# Altium schematic sheet Sheet_Right.SchDoc
size A3
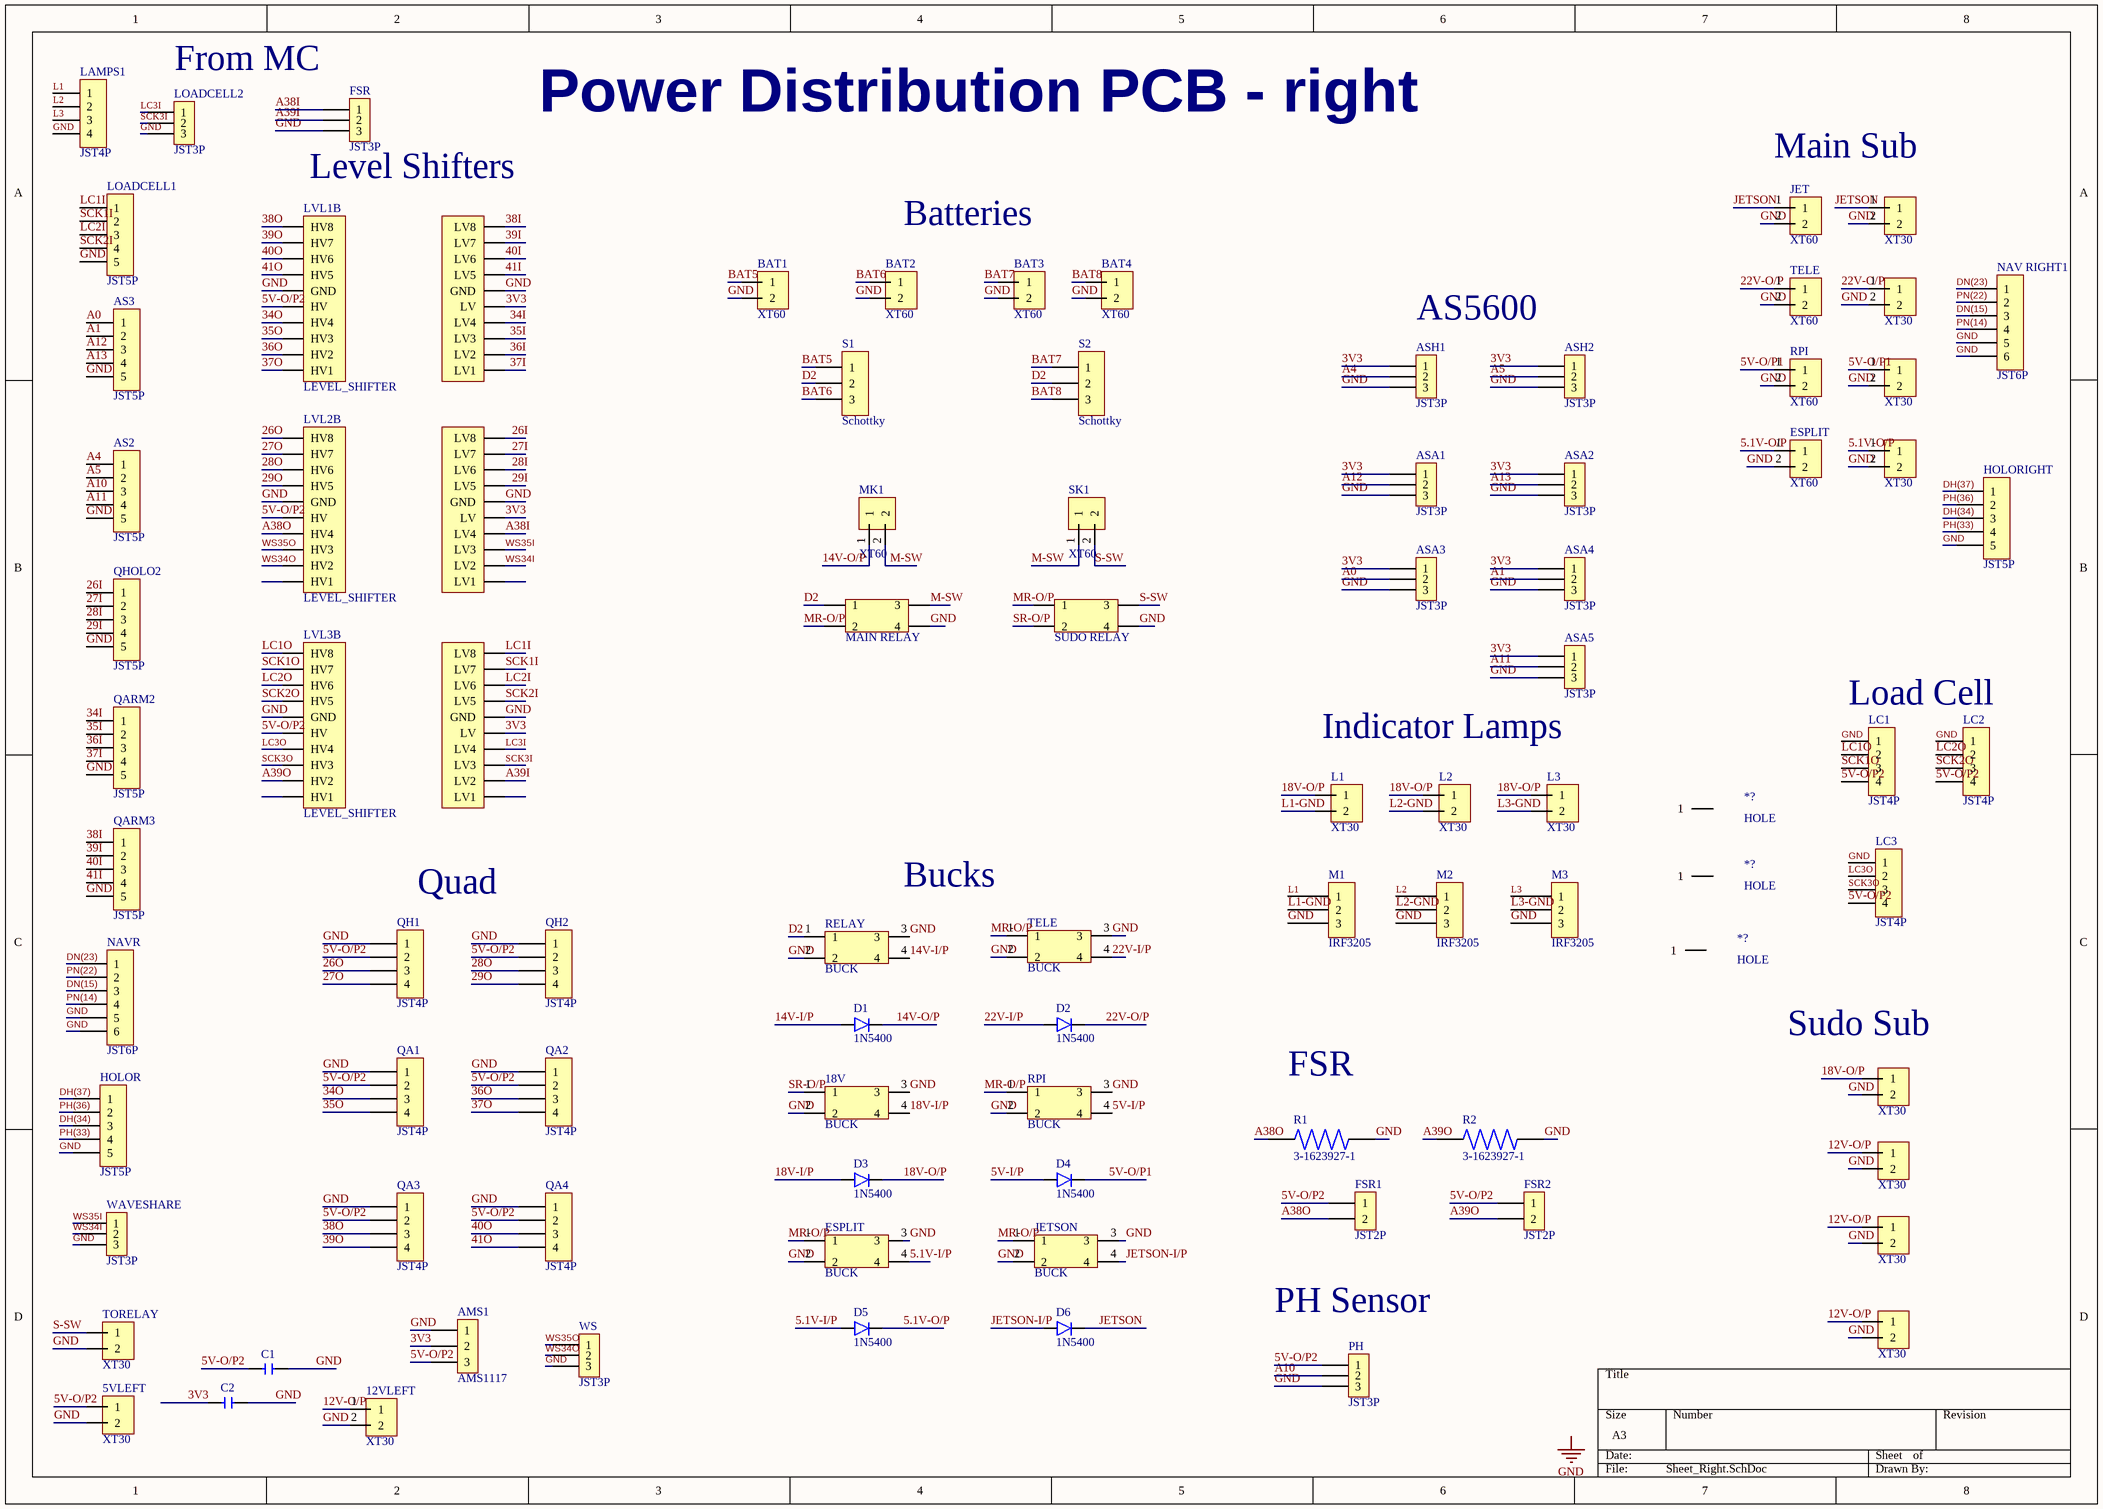
[diagram p0: Sheet_Right.SchDoc]

## Parts
(Parts that share a designator on the sheet are numbered #1, #2 ... from top to bottom, then left to right.)
5VLEFT  XT30  [XT30_FEMALE]
12VLEFT  XT30  [XT30_FEMALE]
18V  BUCK  [BUCKY]
*?#1  HOLE  [HOLE]
*?#2  HOLE  [HOLE]
*?#3  HOLE  [HOLE]
?#1  XT30  [XT30_FEMALE]
?#2  XT30  [XT30_FEMALE]
?#3  XT30  [XT30_FEMALE]
?#4  XT30  [XT30_FEMALE]
AMS1  AMS1117  [AMS1117]
ARM1  XT30  [XT30_FEMALE]
ARM2  XT30  [XT30_FEMALE]
AS2  JST5P  [JST5P]
AS3  JST5P  [JST5P]
ASA1  JST3P  [JST3P]
ASA2  JST3P  [JST3P]
ASA3  JST3P  [JST3P]
ASA4  JST3P  [JST3P]
ASA5  JST3P  [JST3P]
ASH1  JST3P  [JST3P]
ASH2  JST3P  [JST3P]
BAT1  XT60  [XT60_FEMALE]
BAT2  XT60  [XT60_FEMALE]
BAT3  XT60  [XT60_FEMALE]
BAT4  XT60  [XT60_FEMALE]
C1  CERAMIC-4.7UF-50V-10%-X5R(1206)  [C1206]  (value not drawn)
C2  CERAMIC-4.7UF-50V-10%-X5R(1206)  [C1206]  (value not drawn)
D1  1N5400  [DO201-15]
D2  1N5400  [DO201-15]
D3  1N5400  [DO201-15]
D4  1N5400  [DO201-15]
D5  1N5400  [DO201-15]
D6  1N5400  [DO201-15]
ESPLIT#1  XT60  [XT60_FEMALE]
ESPLIT#2  BUCK  [BUCKY]
FSR  JST3P  [JST3P]
FSR1  JST2P  [JST2P]
FSR2  JST2P  [JST2P]
HOLO-R  XT30  [XT30_FEMALE]
HOLOR  JST5P  [JST5P]
HOLORIGHT  JST5P  [JST5P]
JET  XT60  [XT60_FEMALE]
JETSON  BUCK  [BUCKY]
L1  XT30  [XT30_FEMALE]
L2  XT30  [XT30_FEMALE]
L3  XT30  [XT30_FEMALE]
LAMPS1  JST4P  [JST4P]
LC1  JST4P  [JST4P]
LC2  JST4P  [JST4P]
LC3  JST4P  [JST4P]
LOADCELL1  JST5P  [JST5P]
LOADCELL2  JST3P  [JST3P]
LVL1  LEVEL_SHIFTER  [LEVEL_SHIFTER]  (part B of 2)
LVL2  LEVEL_SHIFTER  [LEVEL_SHIFTER]  (part B of 2)
LVL3  LEVEL_SHIFTER  [LEVEL_SHIFTER]  (part B of 2)
M1  IRF3205  [IRF3205]
M2  IRF3205  [IRF3205]
M3  IRF3205  [IRF3205]
MK1  XT60  [XT60_FEMALE]
MR1  MAIN RELAY  [Relay]
NAV-R  XT30  [XT30_FEMALE]
NAV_RIGHT1  JST6P  [JST6P]
NAVR  JST6P  [JST6P]
PH  JST3P  [JST3P]
QA1  JST4P  [JST4P]
QA2  JST4P  [JST4P]
QA3  JST4P  [JST4P]
QA4  JST4P  [JST4P]
QARM2  JST5P  [JST5P]
QARM3  JST5P  [JST5P]
QH1  JST4P  [JST4P]
QH2  JST4P  [JST4P]
QHOLO2  JST5P  [JST5P]
R1  3-1623927-1  [RESAD700W45L350D185]
R2  3-1623927-1  [RESAD700W45L350D185]
RELAY  BUCK  [BUCKY]
RPI#1  XT60  [XT60_FEMALE]
RPI#2  BUCK  [BUCKY]
S1  Schottky  [schottky diode]
S2  Schottky  [schottky diode]
SK1  XT60  [XT60_FEMALE]
SR1  SUDO RELAY  [Relay]
TELE#1  XT60  [XT60_FEMALE]
TELE#2  BUCK  [BUCKY]
TORELAY  XT30  [XT30_FEMALE]
WAVESHARE  JST3P  [JST3P]
WS  JST3P  [JST3P]

## Nets
GND: 5VLEFT.2 12VLEFT.2 18V.2 18V.3 ?#1.2 ?#2.2 ?#3.2 ?#4.2 AMS1.1 ARM1.2 ARM2.2 AS2.5 AS3.5 ASA1.3 ASA2.3 ASA3.3 ASA4.3 ASA5.3 ASH1.3 ASH2.3 BAT1.2 BAT2.2 BAT3.2 BAT4.2 C1.2 C2.2 ESPLIT#1.2 ESPLIT#2.2 ESPLIT#2.3 FSR.3 HOLO-R.2 HOLOR.5 HOLORIGHT.5 JET.2 JETSON.2 JETSON.3 LAMPS1.4 LC1.1 LC2.1 LC3.1 LOADCELL1.5 LOADCELL2.3 LVL1.GND LVL2.GND LVL3.GND M1.3 M2.3 M3.3 MR1.4 NAV-R.2 NAV_RIGHT1.5 NAV_RIGHT1.6 NAVR.5 NAVR.6 PH.3 QA1.1 QA2.1 QA3.1 QA4.1 QARM2.5 QARM3.5 QH1.1 QH2.1 QHOLO2.5 R1.2 R2.2 RELAY.2 RELAY.3 RPI#1.2 RPI#2.2 RPI#2.3 SR1.4 TELE#1.2 TELE#2.2 TELE#2.3 TORELAY.2 WAVESHARE.3 WS.3
3V3: AMS1.2 ASA1.1 ASA2.1 ASA3.1 ASA4.1 ASA5.1 ASH1.1 ASH2.1 C2.1 LVL1.LV LVL2.LV LVL3.LV
5.1V-I/P: D5.A ESPLIT#2.4
5.1V-O/P: ?#4.1 D5.C ESPLIT#1.1
5V-I/P: D4.A RPI#2.4
5V-O/P1: ?#3.1 D4.C RPI#1.1
5V-O/P2: 5VLEFT.1 AMS1.3 C1.1 FSR1.1 FSR2.1 LC1.4 LC2.4 LC3.4 LVL1.HV LVL2.HV LVL3.HV PH.1 QA1.2 QA2.2 QA3.2 QA4.2 QH1.2 QH2.2
12V-O/P: 12VLEFT.1 ARM1.1 ARM2.1 HOLO-R.1
14V-I/P: D1.A RELAY.4
14V-O/P: D1.C MK1.1
18V-I/P: 18V.4 D3.A
18V-O/P: D3.C L1.1 L2.1 L3.1 NAV-R.1
22V-I/P: D2.A TELE#2.4
22V-O/P: ?#2.1 D2.C TELE#1.1
26I: LVL2.LV8 QHOLO2.1
26O: LVL2.HV8 QH1.3
27I: LVL2.LV7 QHOLO2.2
27O: LVL2.HV7 QH1.4
28I: LVL2.LV6 QHOLO2.3
28O: LVL2.HV6 QH2.3
29I: LVL2.LV5 QHOLO2.4
29O: LVL2.HV5 QH2.4
34I: LVL1.LV4 QARM2.1
34O: LVL1.HV4 QA1.3
35I: LVL1.LV3 QARM2.2
35O: LVL1.HV3 QA1.4
36I: LVL1.LV2 QARM2.3
36O: LVL1.HV2 QA2.3
37I: LVL1.LV1 QARM2.4
37O: LVL1.HV1 QA2.4
38I: LVL1.LV8 QARM3.1
38O: LVL1.HV8 QA3.3
39I: LVL1.LV7 QARM3.2
39O: LVL1.HV7 QA3.4
40I: LVL1.LV6 QARM3.3
40O: LVL1.HV6 QA4.3
41I: LVL1.LV5 QARM3.4
41O: LVL1.HV5 QA4.4
A0: AS3.1 ASA3.2
A1: AS3.2 ASA4.2
A4: AS2.1 ASH1.2
A5: AS2.2 ASH2.2
A10: AS2.3 PH.2
A11: AS2.4 ASA5.2
A12: AS3.3 ASA1.2
A13: AS3.4 ASA2.2
A38I: FSR.1 LVL2.LV4
A38O: FSR1.2 LVL2.HV4 R1.1
A39I: FSR.2 LVL3.LV2
A39O: FSR2.2 LVL3.HV2 R2.1
BAT5: BAT1.1 S1.1
BAT6: BAT2.1 S1.3
BAT7: BAT3.1 S2.1
BAT8: BAT4.1 S2.3
D2: MR1.1 RELAY.1 S1.2 S2.2
DH(34): HOLOR.3 HOLORIGHT.3
DH(37): HOLOR.1 HOLORIGHT.1
DN(15): NAV_RIGHT1.3 NAVR.3
DN(23): NAV_RIGHT1.1 NAVR.1
JETSON: ?#1.1 D6.C JET.1
JETSON-I/P: D6.A JETSON.4
L1: LAMPS1.1 M1.1
L1-GND: L1.2 M1.2
L2: LAMPS1.2 M2.1
L2-GND: L2.2 M2.2
L3: LAMPS1.3 M3.1
L3-GND: L3.2 M3.2
LC1I: LOADCELL1.1 LVL3.LV8
LC1O: LC1.2 LVL3.HV8
LC2I: LOADCELL1.3 LVL3.LV6
LC2O: LC2.2 LVL3.HV6
LC3I: LOADCELL2.1 LVL3.LV4
LC3O: LC3.2 LVL3.HV4
M-SW: MK1.2 MR1.3 SK1.1
MR-O/P: ESPLIT#2.1 JETSON.1 MR1.2 RPI#2.1 SR1.1 TELE#2.1
PH(33): HOLOR.4 HOLORIGHT.4
PH(36): HOLOR.2 HOLORIGHT.2
PN(14): NAV_RIGHT1.4 NAVR.4
PN(22): NAV_RIGHT1.2 NAVR.2
S-SW: SK1.2 SR1.3 TORELAY.1
SCK1I: LOADCELL1.2 LVL3.LV7
SCK1O: LC1.3 LVL3.HV7
SCK2I: LOADCELL1.4 LVL3.LV5
SCK2O: LC2.3 LVL3.HV5
SCK3I: LOADCELL2.2 LVL3.LV3
SCK3O: LC3.3 LVL3.HV3
SR-O/P: 18V.1 SR1.2
WS34I: LVL2.LV2 WAVESHARE.2
WS34O: LVL2.HV2 WS.2
WS35I: LVL2.LV3 WAVESHARE.1
WS35O: LVL2.HV3 WS.1

Not connected (* = marked no-connect by the designer): *?#1 1; *?#2 1; *?#3 1; LVL2 HV1 LV1; LVL3 HV1 LV1

## Notes on the sheet
- (near LOADCELL2) From MC
- (near FSR) Level Shifters
- Power Distribution PCB - right
- (near JET) Main Sub
- Batteries
- AS5600
- Load Cell
- Indicator Lamps
- Quad
- Bucks
- (near NAV-R) Sudo Sub
- FSR
- PH Sensor
- Labels drawn without touching a wire or pin: GND

## Library data of the parts
C1 C2 = CERAMIC-4.7UF-50V-10%-X5R(1206): 4.7 ÂµF Â±10% 50V Ceramic Capacitor X5R 1206 (3216 Metric); MF: Yageo; MP: CC1206KKX5R9BB475; SnapEDA_Link: https://www.snapeda.com/parts/CC1206KKX5R9BB475/Yageo/view-part/?ref=snap; Package: SMD-2 Yageo; Value: *; Check_prices: https://www.snapeda.com/parts/CC1206KKX5R9BB475/Yageo/view-part/?ref=eda
D1-D6 = 1N5400: Diode Standard 50 V 3A Through Hole DO-201AD; MF: Diodes Inc.; MP: 1N5400-T; SnapEDA_Link: https://www.snapeda.com/parts/1N5400-T/Diodes+Inc./view-part/?ref=snap; Package: DO-201 Diodes Inc.; Value: *; Check_prices: https://www.snapeda.com/parts/1N5400-T/Diodes+Inc./view-part/?ref=eda
MR1 SR1 = RELAY: Power Relay SPDT 30A 24V; Manufacturer: TE Connectivity; Manufacturer Part Number: V23134A4064X551-EV-CBOX; Supplier 1: Digikey; RoHS: No; Stock 1: 33; Pricing 1: 1=21.98, 10=19.576, 25=18.6936, 50=18.0516, 110=17.34791, 330=16.41191, 550=15.99385 (USD); Supplier Part Number 1: 41-V23134A4064X551-EV-CBOX-ND
R1 R2 = 3-1623927-1: 1 MOhms Â±5% 0.25W, 1/4W Through Hole Resistor Axial - Carbon Film; MF: TE Connectivity; SnapEDA_Link: https://www.snapeda.com/parts/3-1623927-1/TE+Connectivity/view-part/?ref=snap; Package: None; Value: *; MP: 3-1623927-1; Check_prices: https://www.snapeda.com/parts/3-1623927-1/TE+Connectivity/view-part/?ref=eda